# Altium schematic sheet amp-33dbm.SchDoc: RF Amp (33dBm)
size Letter; CheckedBy: J. Brinton; CompanyName: Signal Laboratories, Inc.; DrawnBy: J. Brinton; Engineer: J. Brinton; Address1: 3479 Edison Way; Address2: Menlo Park CA 94025; Address3: +1 (877) 778-8435; Address4: siglabs.com; Revision: 3; SheetNumber: 8; SheetTotal: 49
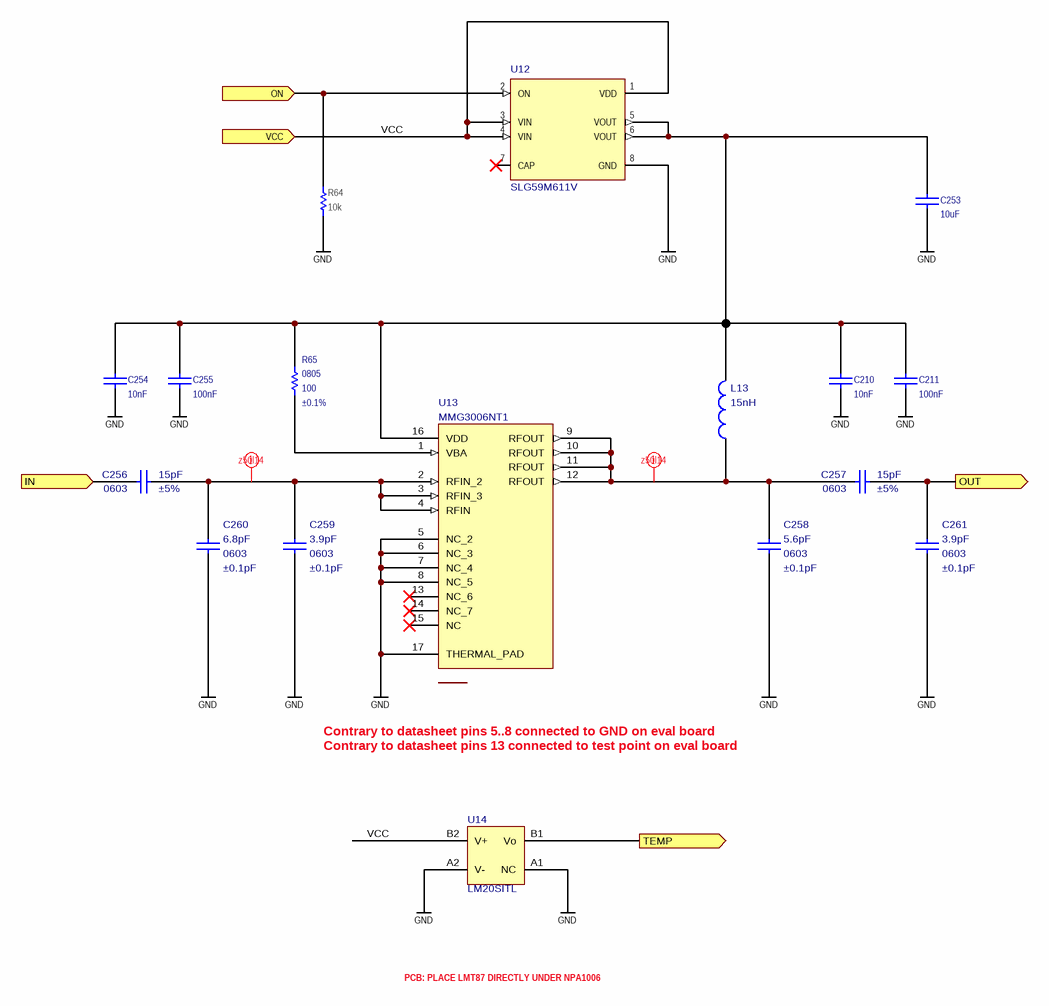
[diagram p0: amp-33dbm.SchDoc]

## Parts
C210  value 10nF  [CAPC100X50X55L25N]  (hidden comment: GRM155R71H103KA88)
C211  value 100nF  [CAPC100X50X55L25N]  (hidden comment: GRM155R71C104KA88J)
C253  value 10uF  [CAPC160X80X90L20N]  (hidden comment: ZRB18AR61E106ME01L)
C254  value 10nF  [CAPC100X50X55L25N]  (hidden comment: GRM155R71H103KA88)
C255  value 100nF  [CAPC100X50X55L25N]  (hidden comment: GRM155R71C104KA88J)
C256  value 15pF  Tolerance: ±5%  Package: 0603  [CAPC160X80X90L20N]  (hidden comment: GQM1885C1H150JB01D)
C257  value 15pF  Tolerance: ±5%  Package: 0603  [CAPC160X80X90L20N]  (hidden comment: GQM1885C1H150JB01D)
C258  value 5.6pF  Tolerance: ±0.1pF  Package: 0603  [CAPC160X80X90L20N]  (hidden comment: 06032U5R6BAT2A)
C259  value 3.9pF  Tolerance: ±0.1pF  Package: 0603  [CAPC160X80X90L20N]  (hidden comment: 06032U3R9BAT2A)
C260  value 6.8pF  Tolerance: ±0.1pF  Package: 0603  [CAPC160X80X90L20N]  (hidden comment: 06032U6R8BAT2A)
C261  value 3.9pF  Tolerance: ±0.1pF  Package: 0603  [CAPC160X80X90L20N]  (hidden comment: 06032U3R9BAT2A)
L13  value 15nH  [1008CS]  (hidden comment: 1008CS-150XJB)
R64  value 10k  [RESC1005X40N]  (hidden comment: ERJ-2RKF1002X)
R65  value 100  Tolerance: ±0.1%  Package: 0805  [RESC2012X70N]  (hidden comment: RG2012P-101-B-T5)
U12  SLG59M611V  [DFN200X150X80-8N]
U13  MMG3006NT1  [QFN65P400X400X90-17N]
U14  LM20SITL  [YZR-4]

## Ports
IN (in), ON (in), OUT (out), TEMP (out), VCC (in)

## Nets
GND: C210.1 C211.1 C253.1 C254.1 C255.1 C258.1 C259.1 C260.1 C261.1 R64.1 U12.8(GND) U13.5(NC_2) U13.6(NC_3) U13.7(NC_4) U13.8(NC_5) U13.17(THERMAL_PAD) U14.A1(NC) U14.A2(V-)
IN: C256.1 ; port IN
ON: R64.2 U12.2(ON) ; port ON
OUT: C257.2 C261.2 ; port OUT
TEMP: U14.B1(Vo) ; port TEMP
VCC: U12.1(VDD) U12.3(VIN) U12.4(VIN) U14.B2(V+) ; port VCC
NetC210_2: C210.2 C211.2 C253.2 C254.2 C255.2 L13.2 R65.2 U12.5(VOUT) U12.6(VOUT) U13.16(VDD)
NetC256_2: C256.2 C259.2 C260.2 U13.2(RFIN_2) U13.3(RFIN_3) U13.4(RFIN)
NetC257_1: C257.1 C258.2 L13.1 U13.9(RFOUT) U13.10(RFOUT) U13.11(RFOUT) U13.12(RFOUT)
NetR65_1: R65.1 U13.1(VBA)

Not connected (* = marked no-connect by the designer): U12 7(CAP)*; U13 13(NC_6)* 14(NC_7)* 15(NC)*

## Layout directives
net class z50l14: NetC256_2, NetC257_1

## Notes on the sheet
- Contrary to datasheet pins 5..8 connected to GND on eval board
- Contrary to datasheet pins 13 connected to test point on eval board
- PCB: PLACE LMT87 DIRECTLY UNDER NPA1006
- Title
- Engineer
- Revision
- Drawn By
- Checked By
- Date
- Sheet
- of

## Library data of the parts
C210 C254 = CAP 0402: Ceramic Capacitor 10nF ±10% 50V X7R 0402; Manufacturer: Murata; Tr: -55:125; Voltage: 50V; Manufacturer P/N: GRM155R71H103KA88; Package: 0402; Tolerance: ±10%
C211 C255 = CAP 0402: Ceramic Capacitor 100nF ±10% 16V X7R 0402; Manufacturer: Murata; Tr: -55:125; Voltage: 16V; Manufacturer P/N: GRM155R71C104KA88J; Package: 0402; Tolerance: ±10%
C253 = CAP 0603: Ceramic Capacitor 10uF ±20% 25V X5R 0603; Manufacturer: Murata; Tr: -55:85; Manufacturer P/N: ZRB18AR61E106ME01L; Voltage: 25V; Package: 0603; Tolerance: ±20%
C256 C257 = CAP: Ceramic Capacitor 15pF ±5% NP0 0603; Manufacturer: Murata; Voltage: 50V; Tr: -55"125; Manufacturer P/N: GQM1885C1H150JB01D
C258 = CAP: Ceramic Capacitor 5.6pF ±0.1pF NP0 0603; Manufacturer: AVX; Voltage: 200V; Tr: -55"125; Manufacturer P/N: 06032U5R6BAT2A
C259 C261 = CAP: Ceramic Capacitor 3.9pF ±0.1pF NP0 0603; Manufacturer: AVX; Voltage: 200V; Tr: -55"125; Manufacturer P/N: 06032U3R9BAT2A
C260 = CAP: Ceramic Capacitor 6.8pF ±0.1pF NP0 0603; Manufacturer: AVX; Voltage: 200V; Tr: -55"125; Manufacturer P/N: 06032U6R8BAT2A
L13 = INDUCTOR: Inductor 15nH 1A; Manufacturer: Coilcraft; Manufacturer P/N: 1008CS-150XJB
R64 = RES: Thick Film Resistor 10k ±1% 0.1W 50V 0402; Manufacturer: Panasonic; Tcr: ±100; Tr: -55:155; Voltage: 50; Power: 0.1; Manufacturer P/N: ERJ-2RKF1002X; Tolerance: ±1%; Alternatives: *; Footprint: *; Package: 0402
R65 = RES: Thin Film Resistor 100 +/-0.1% SMD 0805; Manufacturer: Susumu; Tr: -55:155; Tcr: *; Manufacturer P/N: RG2012P-101-B-T5; Alternatives: *; Voltage: *; Power: *
U12 = SLG59M611V: High-Side Load Switch; Manufacturer: Silego; Package: WFDFN-8 Silego; Manufacturer P/N: SLG59M611V
U13 = MMG3006NT1: RF Amp Chip Single GP 2.4GHz 6V 16-Pin QFN EP T/R; Manufacturer: NXP Semiconductors; Package: QFN-16 NXP Semiconductors; Value: *; Manufacturer P/N: MMG3006NT1
U14 = LM20SITL: Analog Temperature Sensor; Manufacturer: Texas Instruments; Manufacturer P/N: LM20SITL; Package: DSBGA-4